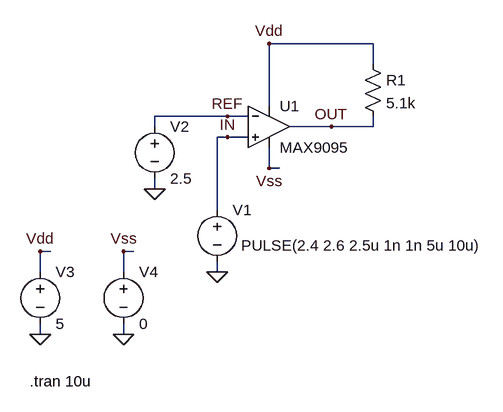
[diagram p0: schematic MAX9095.asc]
MAX9095.asc, the LTspice schematic file:
Version 4
SHEET 1 880 680
WIRE 272 16 112 16
WIRE 272 48 272 16
WIRE 112 112 112 16
WIRE 48 128 -64 128
WIRE 80 128 48 128
WIRE -64 144 -64 128
WIRE 208 144 144 144
WIRE 272 144 272 128
WIRE 272 144 208 144
WIRE 48 160 32 160
WIRE 80 160 48 160
WIRE 112 208 112 176
WIRE 128 208 112 208
WIRE -64 240 -64 224
WIRE 32 272 32 160
WIRE -224 336 -240 336
WIRE -96 336 -112 336
WIRE -240 368 -240 336
WIRE -112 368 -112 336
WIRE 32 368 32 352
WIRE -240 464 -240 448
WIRE -112 464 -112 448
FLAG -240 464 0
FLAG -240 336 Vdd
FLAG -112 464 0
FLAG -112 336 Vss
FLAG 112 208 Vss
FLAG 112 16 Vdd
FLAG 32 368 0
FLAG -64 240 0
FLAG 208 144 OUT
FLAG 48 160 IN
FLAG 48 128 REF
SYMBOL voltage -240 352 R0
SYMATTR InstName V3
SYMATTR Value 5
SYMBOL voltage -112 352 R0
SYMATTR InstName V4
SYMATTR Value 0
SYMBOL res 256 32 R0
SYMATTR InstName R1
SYMATTR Value 5.1k
SYMBOL voltage -64 128 R0
SYMATTR InstName V2
SYMATTR Value 2.5
SYMBOL voltage 32 256 R0
WINDOW 3 37 71 Left 2
WINDOW 123 0 0 Left 0
WINDOW 39 0 0 Left 0
SYMATTR Value PULSE(2.4 2.6 2.5u 1n 1n 5u 10u)
SYMATTR InstName V1
SYMBOL Comparators\\MAX9095 112 144 R0
SYMATTR InstName U1
TEXT -256 536 Left 2 !.tran 10u

The netlist it stands for:
* MAX9095.asc
V3 Vdd 0 5
V4 Vss 0 0
R1 Vdd OUT 5.1k
V2 REF 0 2.5
V1 IN 0 PULSE(2.4 2.6 2.5u 1n 1n 5u 10u)
* U1: MAX9095 (symbol Comparators\MAX9095 not available, pins judged from their places): In+=IN In-=REF V+=Vdd V-=Vss OUT=OUT
.tran 10u
.backanno
.end